# EAGLE design ir-duplicator (EAGLE 8.3.2)
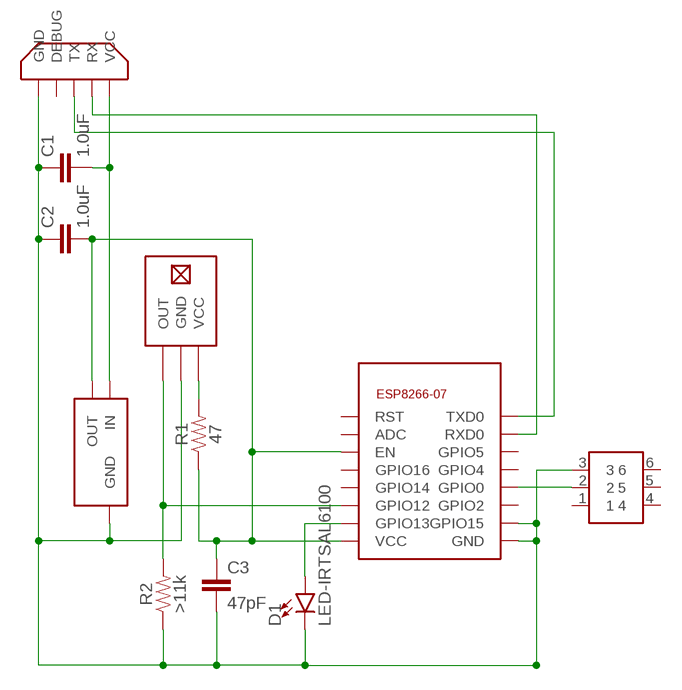
[diagram p0: schematic, sheet 1]

## Parts
C1  1.0uF  1.0UF-0805-25V-10%  [0805]
C2  1.0uF  1.0UF-0805-25V-10%  [0805]
C3  47pF  47PF-0603-50V-5%  [0603]
D1  LED-IRTSAL6100  [LED_5MM]
R1  47  0OHM-0603-1/10W-5%  [0603]
R2  >11k  10KOHM-0603-1/10W-1%  [0603]
U$1  AX-1838HSHORIZ  [AX-1838HS-HORIZ]
U$2  ESP8266-07SMD  [ESP8266-07]
U$3  AYZ0202AGRL  [AYZ0202AGRL]
U$4  MICROUSB609-4613-1-ND  [MICROUSB]
U$5  AZ1117E  [SOT-223]

## Nets
N$1: C1.2 U$4.VCC U$5.P$4(IN)
N$2: C1.1 C2.1 C3.2 D1.K(C) R2.1 U$1.GND U$2.GND U$2.GPIO15 U$3.3 U$4.GND U$5.P$3(GND)
N$3: R2.2 U$1.OUT U$2.GPIO12
N$4: U$2.GPIO0 U$3.2
N$5: C2.2 C3.1 R1.1 U$2.EN U$2.VCC U$5.P$1(OUT) U$5.P$2(OUT)
N$6: U$2.RXD0 U$4.RX
N$7: U$2.TXD0 U$4.TX
N$8: D1.A U$2.GPIO13
N$10: R1.2 U$1.VCC
Unconnected: U$2.ADC U$2.GPIO2 U$2.GPIO4 U$2.GPIO5 U$2.GPIO14 U$2.GPIO16 U$2.RST U$3.1 U$3.4 U$3.5 U$3.6 U$4.DEBUG

## Library data of the parts
C1 C2 = SparkFun-Capacitors:1.0UF: 1µF ceramic capacitors A capacitor is a passive two-terminal electrical component used to store electrical energy temporarily in an electric field.; PROD_ID: CAP-08064
C3 = SparkFun-Capacitors:47PF: 47pF ceramic capacitors A capacitor is a passive two-terminal electrical component used to store electrical energy temporarily in an electric field.; PROD_ID: CAP-08913
D1 = SparkFun-LED:LED-IR: Infrared LED (IR) Wavelength: 940nm Packages: TSAL6100 LTE302 - Side firing. Check SparkFun-Sensors.lbr for the receiver SparkFun Products: ZX Distance and Gesture Sensor <[https://www.sparkfun.com/products/12780]> Infrared Emitters and Detectors <https://www.sparkfun.com/products/241>; PROD_ID: DIO-12058
R1 = SparkFun-Resistors:0OHM: 0Ω resistor A resistor is a passive two-terminal electrical component that implements electrical resistance as a circuit element. Resistors act to reduce current flow, and, at the same time, act to lower voltage levels within circuits. - Wikipedia; PROD_ID: RES-08609; VALUE: 0
R2 = SparkFun-Resistors:10KOHM: 10kΩ resistor A resistor is a passive two-terminal electrical component that implements electrical resistance as a circuit element. Resistors act to reduce current flow, and, at the same time, act to lower voltage levels within circuits. - Wikipedia; PROD_ID: RES-00824; VALUE: 10k
U$1 = IoT:AX-1838HS
U$2 = IoT:ESP8266-07
U$3 = IoT:AYZ0202AGRL
U$4 = IoT:MICROUSB
U$5 = IoT:AZ1117E: AZ1117E - 3.3 volt regulator Technical Specifications: Max Current 1.3 A Connect 1.0 uF cap from GND to IN Connect 1.0 uF cap from GND to OUT

## Board
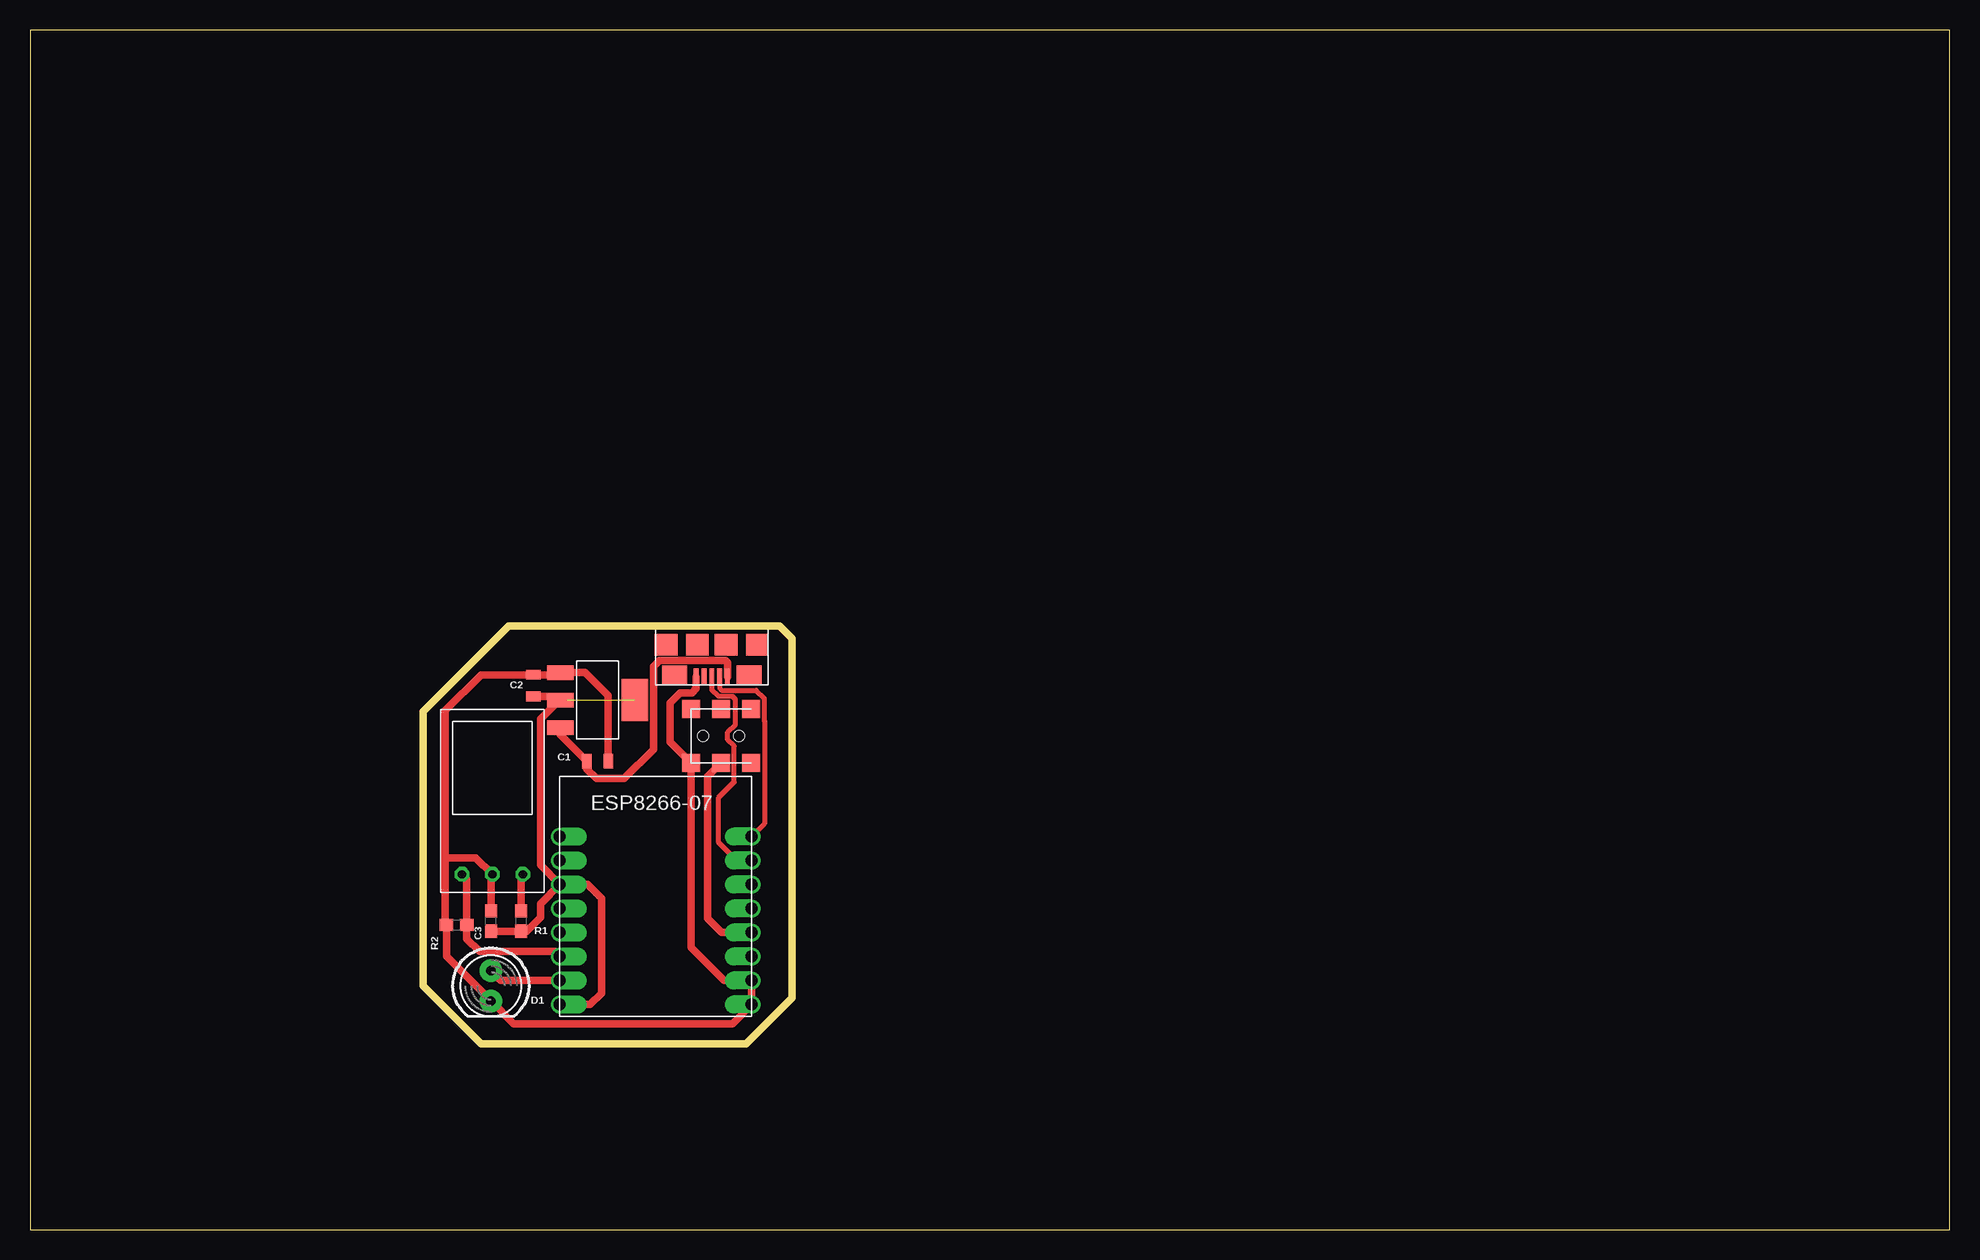
[diagram p1: board, top side]
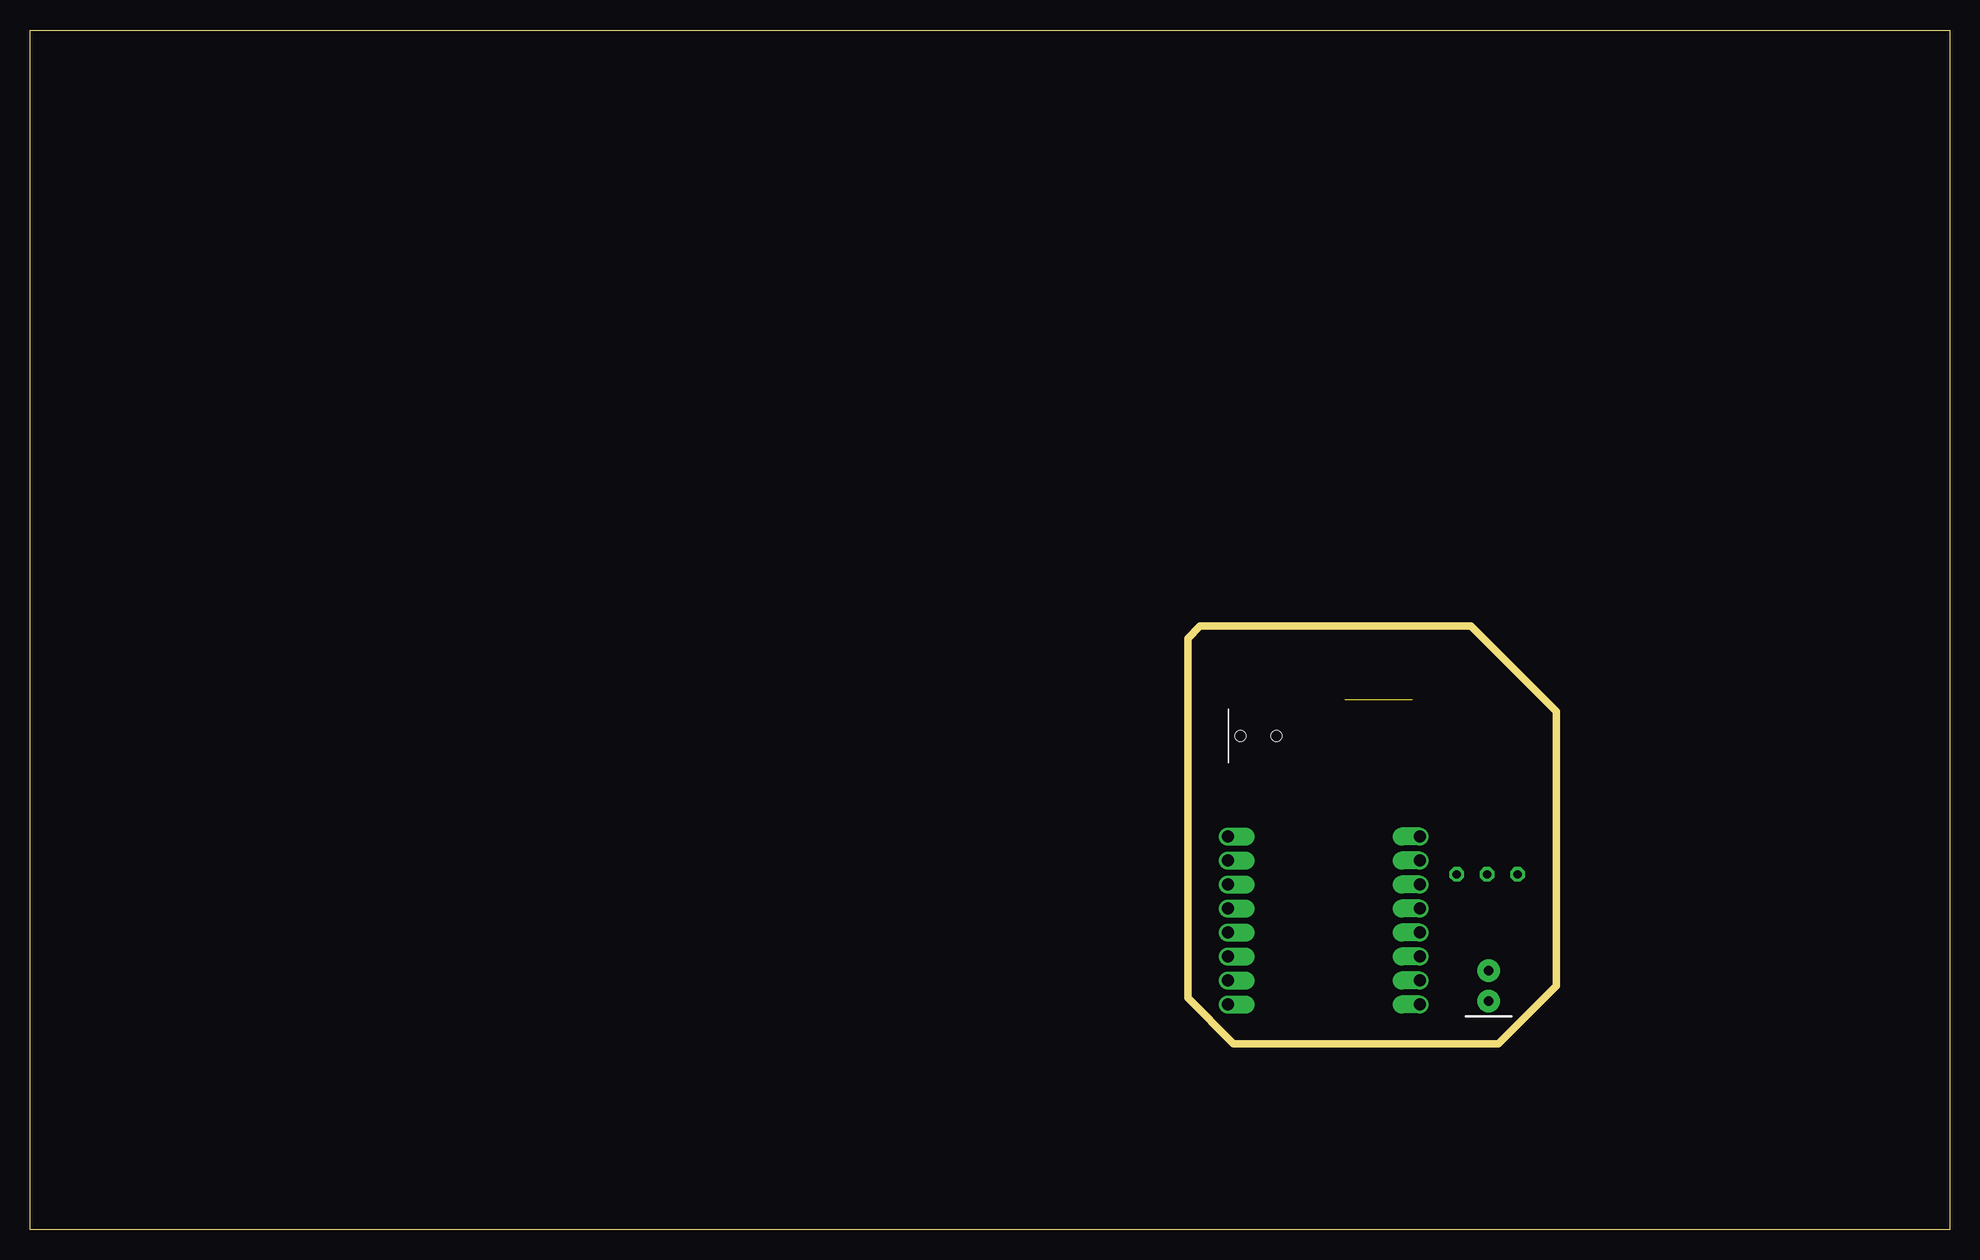
[diagram p2: board, bottom side, seen from below]

Size 160 x 100 mm. Coordinates in mm from the lower left corner, seen from the top.
Outline: 0,0 160,0 160,100 0,100 0,0
Outline: 32.77,43.18 32.77,20.32 37.59,15.49 59.69,15.49 63.5,19.3 63.5,49.28 62.48,50.29 39.88,50.29 32.77,43.18
Copper layers (1*16): Top 0.035mm / dielectric 1.5mm / Bottom 0.035mm
Design rules "default": minimum track width 6mil, minimum drill 0.35mm, track to track 6mil, track to pad 6mil, pad to pad 6mil, via to via 6mil, smd to smd 6mil, copper to edge 40mil, drill to drill 6mil, minimum pad ring 10mil, minimum via ring 8mil, stop-mask expansion 4mil, vias tented up to drill 0mil, thermal gap 10mil

### Footprints (pad centres in the part's own frame; a part is rotated, then mirrored left to right if it is on the bottom)
0805 = smd 0.8 x 1.2: 1 -0.9,0; 2 0.9,0
0603 = smd 1.1 x 1: 1 -0.85,0; 2 0.85,0
LED_5MM = drill 0.813 pad 1.88: A -1.27,0; K 1.27,0
AX-1838HS-HORIZ = drill 0.7 octagon: GND 3.3,-5; OUT 0.76,-5; VCC 5.84,-5
ESP8266-07 = drill 1 pad 1.2 offset: ADC -6,6; EN -6,4; GND 10,-6; GPIO0 10,0; GPIO2 10,-2; GPIO4 10,2; GPIO5 10,4; GPIO12 -6,-2; GPIO13 -6,-4; GPIO14 -6,0; GPIO15 10,-4; GPIO16 -6,2; RST -6,8; RXD0 10,6; TXD0 10,8; VCC -6,-6
AYZ0202AGRL = smd 1.5 x 1.5: 1 -2.5,2.25; 2 0,2.25; 3 2.5,2.25; 4 -2.5,-2.25; 5 0,-2.25; 6 2.5,-2.25 | hole 0.9: -1.5,0; 1.5,0
MICROUSB = smd 0.4 x 1.35: DEBUG -0.65,0.675; GND -1.3,0.675; RX 0,0.675; TX 0.65,0.675; VCC 1.3,0.675 | smd 2.1 x 1.6: P$1 3.1,0.8; P$6 -3.1,0.8 | smd 1.9 x 1.8: P$2 3.8,3.35; P$3 -3.8,3.35; P$5 -1.2,3.35; P$7 1.2,3.35
SOT-223 = smd 3.5 x 2.2: P$1 0,3.1 | smd 1.2 x 2.2: P$2 0,-3.1; P$3 -2.3,-3.1; P$4 2.3,-3.1

### Placement (x,y rotation side)
C1  47.31,39.05 180 top
C2  41.94,45.34 270 top
C3  38.42,25.72 90 top
D1  38.42,20.32 270 top
R1  40.96,25.72 90 top
R2  35.56,25.4 0 top
U$1  35.24,34.61 0 top
U$2  50.16,24.77 0 top
U$3  57.59,41.15 180 top
U$4  56.83,45.4 0 top
U$5  47.31,44.13 270 top

### Tracks (layer width: path | path; a pad name or v marks a point on that pad's centre or on a via)
N$1
  Top 0.61: 46.4,39.06 C1.2 | U$5.P$4 44.21,41.25 C1.2 | C1.2 46.41,38.4 47.21,37.59 49.53,37.59 51.98,40.04 51.98,46.94 52.47,47.43 57.98,47.43 58.13,47.28 U$4.VCC
N$2
  Top 0.61: U$5.P$3 46.28,46.43 48.21,44.5 C1.1 | 44.13,46.35 U$5.P$3 | C3.2 38.42,29.48 U$1.GND 37.16,30.99 34.62,30.99 | 34.62,30.99 34.62,25.49 R2.1 34.71,22.76 D1.K 40.32,17.14 58.55,17.14 U$2.GND U$2.GPIO15 57.85,20.77 55.09,23.52 U$3.3 53.34,40.65 53.34,43.88 54.2,44.74 55.18,44.74 55.53,45.09 U$4.GND | 34.62,30.99 34.62,43.27 37.59,46.24 C2.1 44.01,46.24 U$5.P$3 | U$5.P$3
N$3
  Top 0.61: 36.41,25.08 R2.2 | 36.41,25.08 36.41,24.23 37.47,23.18 43.75,23.18 U$2.GPIO12 | U$1.OUT 36.41,29.2 36.41,25.08
N$4
  Top 0.61: U$3.2 56.48,37.79 56.48,25.94 57.66,24.77 U$2.GPIO0 58.83,24.77
N$5  (1 unrouted)
  Top 0.61: U$5.P$2 44.77,44.13 | C3.1 R1.1 41.38,24.87 42.55,26.04 42.55,27.14 U$2.EN | U$2.EN 46.48,28.77 47.62,27.62 47.62,19.68 46.7,18.77 U$2.VCC | U$2.EN 42.55,30.39 42.55,42.55 44.13,44.13 U$5.P$2 | C2.2 43.9,44.44 U$5.P$2
N$6
  Top 0.406: U$4.RX 56.83,44.99 57.39,44.44 58.56,44.44 58.8,44.2 58.8,42.1 58.17,41.47 58.17,40.83 58.7,40.3 58.7,37.3 57.4,36.01 57.4,32.26 58.9,30.77 U$2.RXD0
N$7
  Top 0.406: U$4.TX 57.48,45.13 57.66,44.96 60.54,44.96 61.2,44.3 61.2,42.43 61.21,42.42 61.21,33.81 U$2.TXD0
N$8
  Top 0.61: U$2.GPIO13 39.24,20.77 D1.A
N$10
  Top 0.61: U$1.VCC 40.96,29.48 R1.2

### Text on the board
tValues: DBG